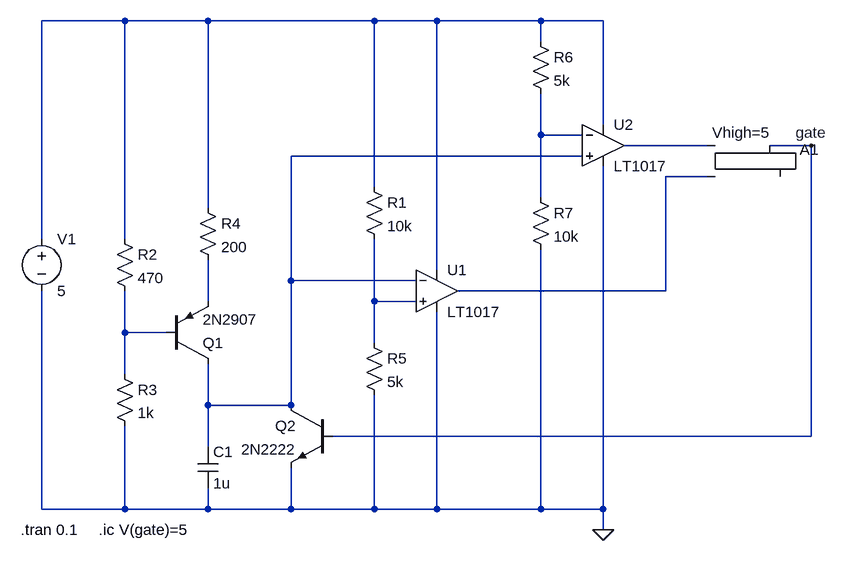
[diagram p0: schematic sawtooth.asc]
sawtooth.asc, the LTspice schematic file:
Version 4
SHEET 1 1148 680
WIRE 48 -336 -80 -336
WIRE 176 -336 48 -336
WIRE 432 -336 176 -336
WIRE 528 -336 432 -336
WIRE 688 -336 528 -336
WIRE 784 -336 688 -336
WIRE 688 -304 688 -336
WIRE 784 -176 784 -336
WIRE 688 -160 688 -224
WIRE 752 -160 688 -160
WIRE 944 -144 816 -144
WIRE 1104 -144 1040 -144
WIRE 752 -128 304 -128
WIRE 944 -96 880 -96
WIRE 432 -80 432 -336
WIRE 688 -64 688 -160
WIRE 176 -48 176 -336
WIRE -80 0 -80 -336
WIRE 48 0 48 -336
WIRE 528 48 528 -336
WIRE 304 64 304 -128
WIRE 496 64 304 64
WIRE 880 80 880 -96
WIRE 880 80 560 80
WIRE 176 96 176 32
WIRE 432 96 432 0
WIRE 496 96 432 96
WIRE 48 144 48 80
WIRE 112 144 48 144
WIRE 432 160 432 96
WIRE 48 208 48 144
WIRE 176 256 176 192
WIRE 304 256 304 64
WIRE 304 256 176 256
WIRE 1104 304 1104 -144
WIRE 1104 304 368 304
WIRE 176 320 176 256
WIRE -80 416 -80 80
WIRE 48 416 48 288
WIRE 48 416 -80 416
WIRE 176 416 176 384
WIRE 176 416 48 416
WIRE 304 416 304 352
WIRE 304 416 176 416
WIRE 432 416 432 240
WIRE 432 416 304 416
WIRE 528 416 528 112
WIRE 528 416 432 416
WIRE 688 416 688 16
WIRE 688 416 528 416
WIRE 784 416 784 -112
WIRE 784 416 688 416
WIRE 784 448 784 416
FLAG 1104 -144 gate
FLAG 784 448 0
SYMBOL pnp 112 192 M180
SYMATTR InstName Q1
SYMATTR Value 2N2907
SYMBOL res 32 -16 R0
SYMATTR InstName R2
SYMATTR Value 470
SYMBOL res 32 192 R0
SYMATTR InstName R3
SYMATTR Value 1k
SYMBOL res 160 -64 R0
SYMATTR InstName R4
SYMATTR Value 200
SYMBOL cap 160 320 R0
SYMATTR InstName C1
SYMATTR Value 1u
SYMBOL npn 368 256 M0
SYMATTR InstName Q2
SYMATTR Value 2N2222
SYMBOL res 416 -96 R0
SYMATTR InstName R1
SYMATTR Value 10k
SYMBOL res 416 144 R0
SYMATTR InstName R5
SYMATTR Value 5k
SYMBOL res 672 -320 R0
SYMATTR InstName R6
SYMATTR Value 5k
SYMBOL res 672 -80 R0
SYMATTR InstName R7
SYMATTR Value 10k
SYMBOL Comparators\\LT1017 528 80 R0
SYMATTR InstName U1
SYMBOL Comparators\\LT1017 784 -144 R0
SYMATTR InstName U2
SYMBOL Digital\\srflop 992 -192 R0
WINDOW 3 -40 28 Left 2
SYMATTR Value Vhigh=5
SYMATTR InstName A1
SYMBOL voltage -80 -16 R0
WINDOW 123 0 0 Left 0
WINDOW 39 0 0 Left 0
SYMATTR InstName V1
SYMATTR Value 5
TEXT -112 448 Left 2 !.tran 0.1
TEXT 8 448 Left 2 !.ic V(gate)=5

The netlist it stands for:
* sawtooth.asc
Q1 N004 N008 N006 0 2N2907
R2 N001 N008 470
R3 N008 0 1k
R4 N001 N006 200
C1 N004 0 1u
Q2 N004 gate 0 0 2N2222
R1 N001 N007 10k
R5 N007 0 5k
R6 N001 N002 5k
R7 N002 0 10k
XU1 N007 N004 N001 0 N005 LT1017  ; pins In+ In- V+ V- OUT
XU2 N004 N002 N001 0 N003 LT1017  ; pins In+ In- V+ V- OUT
A1 N003 N005 0 0 0 0 gate 0 SRFLOP Vhigh=5
V1 N001 0 5
.model NPN NPN
.model PNP PNP
.lib standard.bjt
.tran 0.1
.ic V(gate)=5
.backanno
.end